# Altium project Four-leg robot.PrjPcb
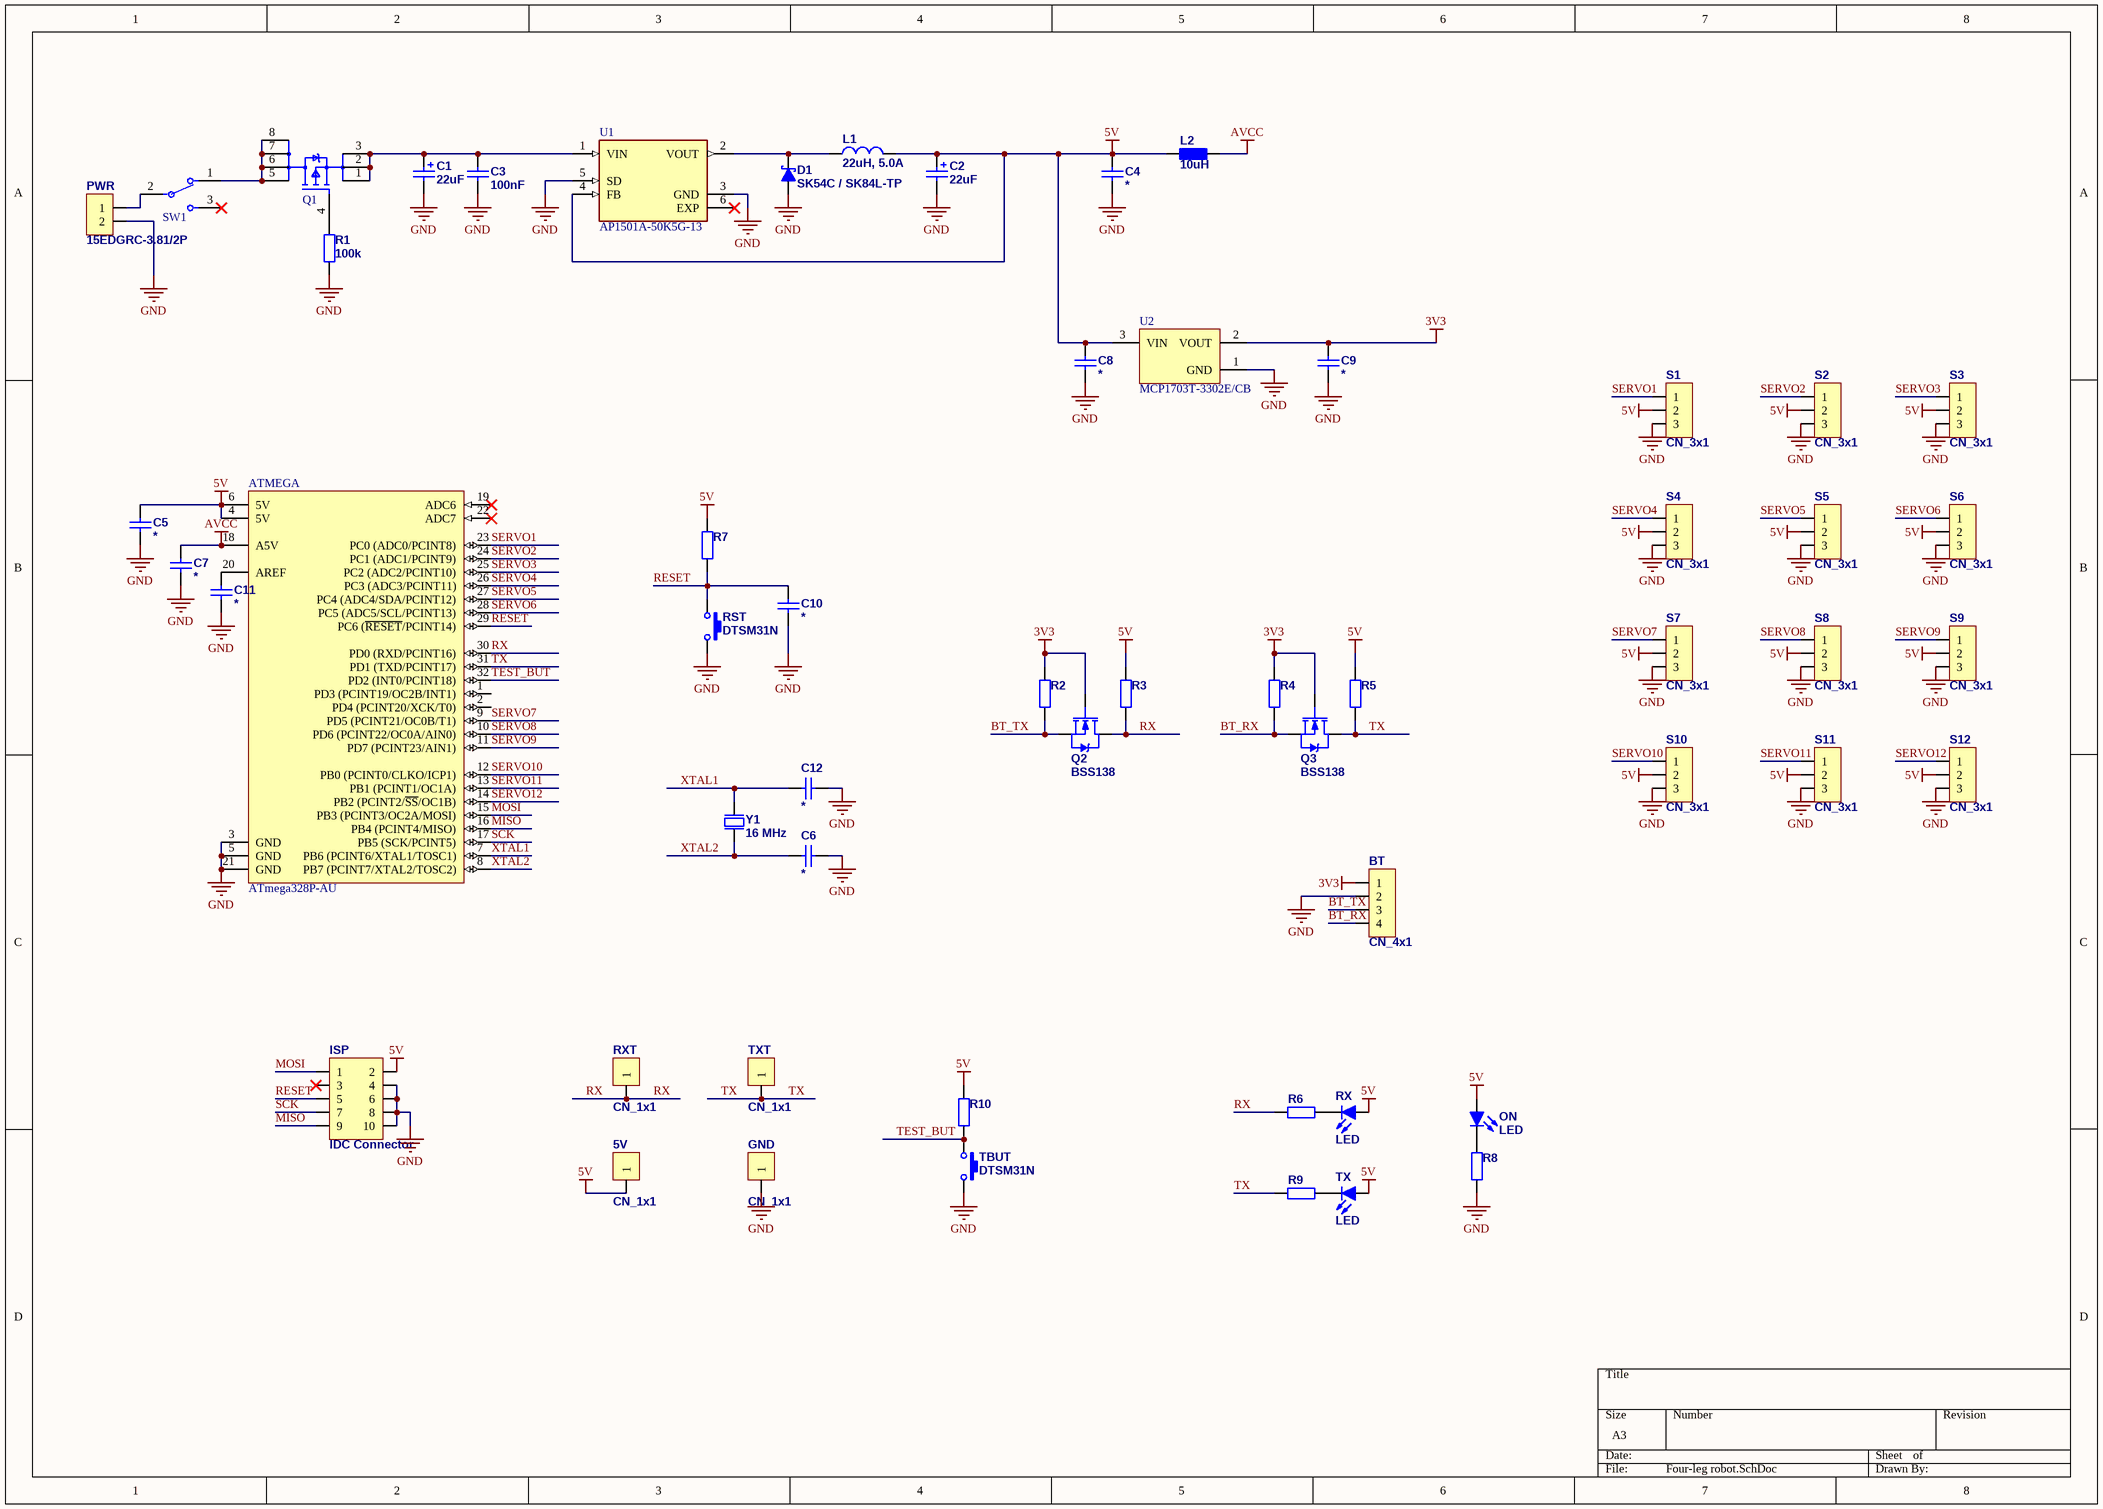
[diagram p0: Four-leg robot.SchDoc]
1 sheet, 57 parts. Net scope: global (net labels, ports and power ports of the same name join across sheets).
Board file: Four-leg robot.PcbDoc

## Sheet Four-leg robot.SchDoc
size A3

### Parts
5V  CN_1x1  [GP_1x1]
ATMEGA  ATmega328P-AU  [32A_N]
BT  CN_4x1  [GP_4x1_F]
C1  22uF  [SMDB]
C2  22uF  [SMDB]
C3  100nF  [C0805]
C4  *  [C0805]
C5  *  [C0805]
C6  *  [C0805]
C7  *  [C0805]
C8  *  [C0805]
C9  *  [C0805]
C10  *  [C0805]
C11  *  [C0805]
C12  *  [C0805]
D1  SK54C / SK84L-TP  [SMC]
GND  CN_1x1  [GP_1x1]
ISP  IDC Connector  [IDC10]
L1  22uH, 5.0A  [DE1209]
L2  10uH  [L0805]
ON  LED  [LED0805G]
PWR  15EDGRC-3.81/2P  [15EDGRC-3.81/2P_WO_CN]
Q1  IRF7425PBF  [Infineon_PG-DSO-8_MFG]  (value not drawn)
Q2  BSS138  [SOT-23]
Q3  BSS138  [SOT-23]
R1  100k  [R0805]
R2  (no value)  [R0805]
R3  (no value)  [R0805]
R4  (no value)  [R0805]
R5  (no value)  [R0805]
R6  (no value)  [R0805]
R7  (no value)  [R0805]
R8  (no value)  [R0805]
R9  (no value)  [R0805]
R10  (no value)  [R0805]
RST  DTSM31N  [DTSM-3]
RX  LED  [LED0805G]
RXT  CN_1x1  [GP_1x1]
S1  CN_3x1  [GP_3x1]
S2  CN_3x1  [GP_3x1]
S3  CN_3x1  [GP_3x1]
S4  CN_3x1  [GP_3x1]
S5  CN_3x1  [GP_3x1]
S6  CN_3x1  [GP_3x1]
S7  CN_3x1  [GP_3x1]
S8  CN_3x1  [GP_3x1]
S9  CN_3x1  [GP_3x1]
S10  CN_3x1  [GP_3x1]
S11  CN_3x1  [GP_3x1]
S12  CN_3x1  [GP_3x1]
SW1  Switch_C&K_1101M2S3CQE2_eec  [C&K_1101M2S3CQE2_0]  (value not drawn)
TBUT  DTSM31N  [DTSM-3]
TX  LED  [LED0805G]
TXT  CN_1x1  [GP_1x1]
U1  AP1501A-50K5G-13  [TO-263-5]
U2  MCP1703T-3302E/CB  [SOT-23]
Y1  16 MHz  [HC49-S]

### Nets
3V3: BT.1 C9.2 Q2.1(G) Q3.1(G) R2.2 R4.2 U2.2(VOUT)
5V: 5V.1 ATMEGA.4(5V) ATMEGA.6(5V) C2.1 C4.2 C5.2 C8.2 ISP.2 L1.2 L2.1 ON.1(A) R3.2 R5.2 R7.2 R10.2 RX.1(A) S1.2 S2.2 S3.2 S4.2 S5.2 S6.2 S7.2 S8.2 S9.2 S10.2 S11.2 S12.2 TX.1(A) U1.4(FB) U2.3(VIN)
AVCC: ATMEGA.18(A5V) C7.2 L2.2
GND: ATMEGA.3(GND) ATMEGA.5(GND) ATMEGA.21(GND) BT.2 C1.2 C2.2 C3.1 C4.1 C5.1 C6.1 C7.1 C8.1 C9.1 C10.1 C11.1 C12.1 D1.1(A) GND.1 ISP.4 ISP.6 ISP.8 ISP.10 PWR.2 R1.1 R8.1 RST.2 S1.3 S2.3 S3.3 S4.3 S5.3 S6.3 S7.3 S8.3 S9.3 S10.3 S11.3 S12.3 TBUT.2 U1.3(GND) U1.5(SD) U2.1(GND)
BT_RX: BT.4 Q3.2(S) R4.1
BT_TX: BT.3 Q2.2(S) R2.1
MISO: ATMEGA.16(PB4_(PCINT4/MISO)) ISP.9
MOSI: ATMEGA.15(PB3_(PCINT3/OC2A/MOSI)) ISP.1
RESET: ATMEGA.29(PC6_(~{RESET}/PCINT14)) C10.2 ISP.5 R7.1 RST.1
RX: ATMEGA.30(PD0_(RXD/PCINT16)) Q2.3(D) R3.1 R6.1 RXT.1
SCK: ATMEGA.17(PB5_(SCK/PCINT5)) ISP.7
SERVO1: ATMEGA.23(PC0_(ADC0/PCINT8)) S1.1
SERVO2: ATMEGA.24(PC1_(ADC1/PCINT9)) S2.1
SERVO3: ATMEGA.25(PC2_(ADC2/PCINT10)) S3.1
SERVO4: ATMEGA.26(PC3_(ADC3/PCINT11)) S4.1
SERVO5: ATMEGA.27(PC4_(ADC4/SDA/PCINT12)) S5.1
SERVO6: ATMEGA.28(PC5_(ADC5/SCL/PCINT13)) S6.1
SERVO7: ATMEGA.9(PD5_(PCINT21/OC0B/T1)) S7.1
SERVO8: ATMEGA.10(PD6_(PCINT22/OC0A/AIN0)) S8.1
SERVO9: ATMEGA.11(PD7_(PCINT23/AIN1)) S9.1
SERVO10: ATMEGA.12(PB0_(PCINT0/CLKO/ICP1)) S10.1
SERVO11: ATMEGA.13(PB1_(PCINT1/OC1A)) S11.1
SERVO12: ATMEGA.14(PB2_(PCINT2/~{SS}/OC1B)) S12.1
TEST_BUT: ATMEGA.32(PD2_(INT0/PCINT18)) R10.1 TBUT.1
TX: ATMEGA.31(PD1_(TXD/PCINT17)) Q3.3(D) R5.1 R9.1 TXT.1
XTAL1: ATMEGA.7(PB6_(PCINT6/XTAL1/TOSC1)) C12.2 Y1.2(OSC2)
XTAL2: ATMEGA.8(PB7_(PCINT7/XTAL2/TOSC2)) C6.2 Y1.1(OSC1)
NetATMEGA_20: ATMEGA.20(AREF) C11.2
NetC1_1: C1.1 C3.2 Q1.1(S) Q1.2(S) Q1.3(S) U1.1(VIN)
NetD1_2: D1.2(K) L1.1 U1.2(VOUT)
NetON_2: ON.2(K) R8.2
NetPWR_1: PWR.1 SW1.2(COM)
NetQ1_4: Q1.4(G) R1.2
NetQ1_5: Q1.5(D) Q1.6(D) Q1.7(D) Q1.8(D) SW1.1
NetR6_2: R6.2 RX.2(K)
NetR9_2: R9.2 TX.2(K)

Not connected (* = marked no-connect by the designer): ATMEGA 1(PD3_(PCINT19/OC2B/INT1)) 2(PD4_(PCINT20/XCK/T0)) 19(ADC6)* 22(ADC7)*; ISP 3*; SW1 3*; U1 6(EXP)*

### Library data of the parts
ATMEGA = ATmega328P-AU: 8-bit AVR Microcontroller, 32KB Flash, 1KB EEPROM, 2KB SRAM, 32-pin TQFP, Industrial Grade (-40°C to 85°C); DatasheetVersion: revD, May-2011; PackageVersion: revC, Oct-2010; PackageReference: 32A; PackageDescription: 32-Lead, 7x7x1.0 mm Body, 0.8mm Lead Pitch, Thin Profile Plastic Quad Flat Package (TQFP); Code_JEDEC: MS-026-ABA; ComponentLink1Description: Manufacturer URL; ComponentLink1URL: http://www.atmel.com/; ComponentLink2Description: ATmega48A/48PA/88A/88PA/168A/168PA/328/328P Datasheet; ComponentLink2URL: http://www.atmel.com/dyn/resources/prod_documents/doc8271.pdf; ComponentLink3Description: ATmega48A/48PA/88A/88PA/168A/168PA/328/328P Summary; ComponentLink3URL: http://www.atmel.com/dyn/resources/prod_documents/8271S.pdf
C1 C2 = Cap Pol Tant: Polarized Tantalum Capacitor; ComponentLink1Description: datasheet; ComponentLink2Description: supplier; Value: 22uF
C3-C12 = Cap: Capacitor; ComponentLink1Description: datasheet; ComponentLink2Description: supplier
  C3: Value: 100nF
  C4-C12: Value: *
D1 = SK54C: Schottky Diode: 40V, 5A; Published: 08-Mar-2006; PackageReference: SOT-23; Supplier 1: Farnell; Supplier Part Number 1: 1299291
ISP = CN_5x2
L1 = DE1209-22: Published: 08-Mar-2006; ComponentLink1Description: datasheet; ComponentLink2Description: supplier; Supplier 1: TME; Value: 22uH, 5.0A; Supplier Part Number 1: DE1209-22
L2 = Ind2: Inductor; Published: 19-Feb-2006; ComponentLink1Description: datasheet; ComponentLink2Description: supplier; Value: 10uH
ON RX TX = LED: Typical RED, GREEN, YELLOW, AMBER GaAs LED; Published: 04-Apr-2006
PWR = 15EDGRC-3.81/2P: Degson 7A, 250V, 2 Pole Plug-in Terminal Block; link: https://www.tme.eu/pl/details/15edgk3.81-02p/listwy-zaciskowe-rozlaczalne/degson-electronics/15edgk-3-81-02p-14-00a-h/
Q2 Q3 = BSS138: N-Channel Enhancement Mode Vertical DMOS FET; Published: 17-Dec-2003; DatasheetVersion: Mar-96; PackageVersion: 1996; PackageReference: SOT23; Publisher: Altium Limited; PackageDescription: SOT-23; 3 Leads; Body 3.1 x 2.5 mm, inc. leads (LxW max), Alternate Lead Configuration; ComponentLink1Description: Manufacturer Link; ComponentLink1URL: http://www.zetex.com/; ComponentLink2Description: Datasheet; ComponentLink2URL: www.zetex.com/3.0/pdf/BSS138.pdf
R1-R10 = Res: Resistor; Published: 19-Feb-2006; ComponentLink1Description: datasheet; ComponentLink2Description: supplier
  R1: Value: 100k
RST TBUT = DTSM31N: DIPTRONICS 6x3,5mm SMD Tactile SPST-NO Switch
SW1 = Switch_C&K_1101M2S3CQE2_eec: SWITCH SLIDE SPDT 6A 120V; Manufacturer: C&K; Part Number: 1101M2S3CQE2; helpURL: https://upverter.com/upn/revision/403d1beb71d14239/; ComponentLink2Description: Datasheet; Temperature: -30° to +65°; Package: CONN_PTH_BNC; Supplier 2: Mouser; Price: 2.74673798286; Supplier 1: Digi-Key; ComponentLink1URL: https://upverter.com/upn/revision/403d1beb71d14239/; Supplier Part Number 2: 611-1101M2S3CQE2; Supplier Part Number 1: CKN5001-ND; ComponentLink1Description: Upverter; ComponentLink2URL: https://upverter.com/datasheet/a7139684b05aeea94593aa7ac14a507e079abd51.pdf; RoHS: TRUE; Mouser Part Number: 611-1101M2S3CQE2; Digikey Description: SWITCH SLIDE SPDT 6A 120V; Digikey Part Number: CKN5001-ND; Lead Free: yes; Temperature Range Low: -30°; Temperature Range High: +65°
U1 = AP1501A-33K5G-13: Voltage stabiliser; PMIC; 5A; TO263-5; SMD; buck; -20Ã·85Â°C; 800pcs.; Package: None; Price: None; Value: *; MP: AP1501A-50K5G-13; Availability: Unavailable
U2 = MCP1703T-3302E/CB: 250 mA, 16V, Low Quiescent Current LDO Regulator, 3-Pin SOT-23A, Extended Temperature, Tape and Reel; PackageVersion: revBB, Aug-2009; PackageReference: SOT-23A-CB3; PackageDescription: 3-Lead Plastic Small Outline Transistor (CB) [SOT-23A]; DatasheetVersion: revD, Sep-2009; PartNumber: MCP1703T-3302E/CB
Y1 = XTAL_2PIN: Crystal Oscillator; ComponentLink1Description: datasheet; ComponentLink2Description: supplier; Value: 16 MHz
Q1 = IRF7425PBF: link: https://www.tme.eu/pl/details/irf7425trpbf/tranzystory-z-kanalem-p-smd/infineon-technologies/; inny trans: https://www.tme.eu/pl/details/dmp3036sss-13/tranzystory-z-kanalem-p-smd/diodes-incorporated/; jeszcze inny trans: https://www.tme.eu/pl/details/ao4447a/tranzystory-z-kanalem-p-smd/alpha-omega-semiconductor/